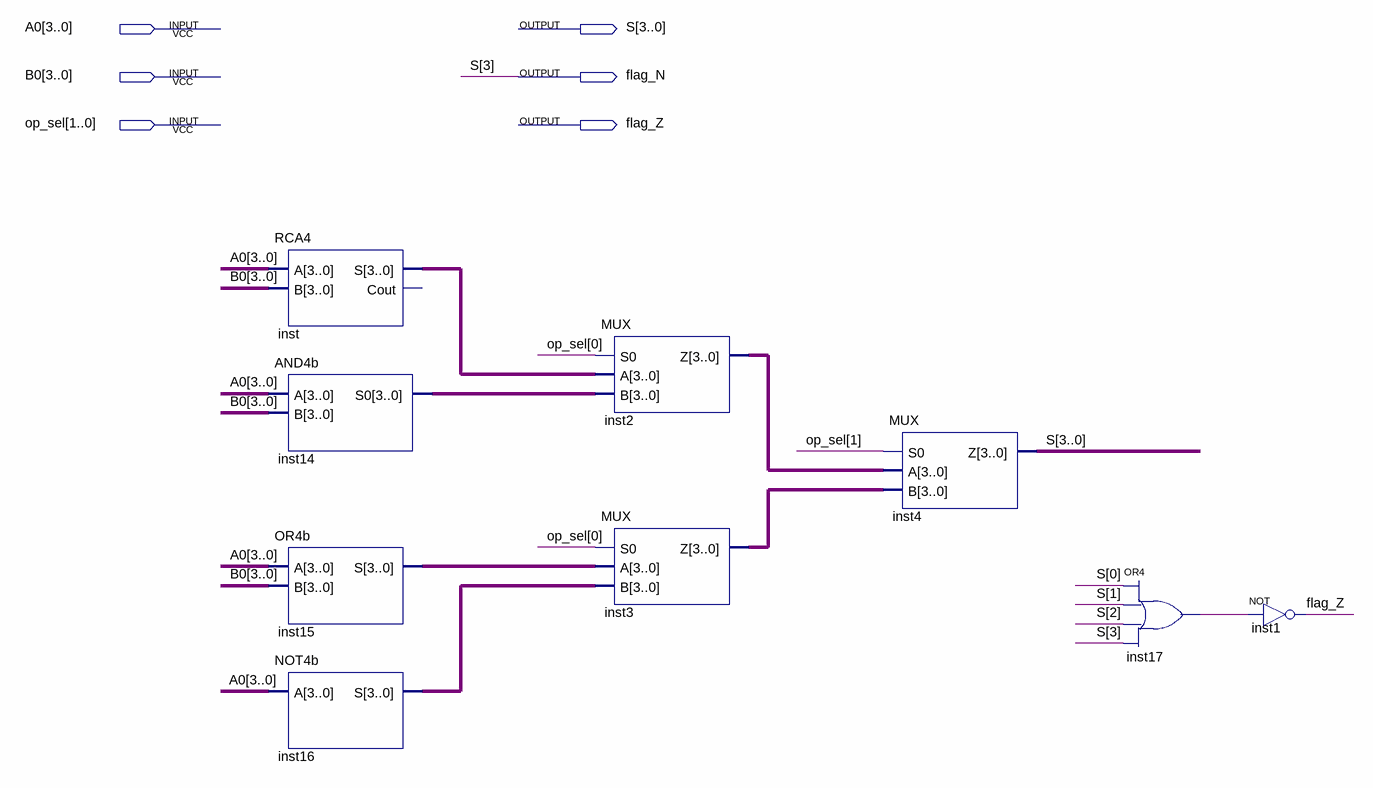
[diagram p0: schematic sheet]
// Quartus schematic ULA.bdf as structural Verilog: 9 symbols, 6 pins
module ULA (
  input  [3:0] A0,
  input  [3:0] B0,
  input  [1:0] op_sel,
  output [3:0] S,
  output flag_N,
  output flag_Z
);

  wire inst17_out;
  wire [3:0] inst2_z, inst3_z, inst14_s0, inst15_s, inst16_s, inst_s;

  RCA4 inst (.A(A0), .B(B0), .S(inst_s));  // open: Cout
  AND4b inst14 (.A(A0), .B(B0), .S0(inst14_s0));
  OR4b inst15 (.A(A0), .B(B0), .S(inst15_s));
  NOT4b inst16 (.A(A0), .S(inst16_s));
  MUX inst2 (.S0(op_sel[0]), .A(inst_s), .B(inst14_s0), .Z(inst2_z));
  MUX inst3 (.S0(op_sel[0]), .A(inst15_s), .B(inst16_s), .Z(inst3_z));
  MUX inst4 (.S0(op_sel[1]), .A(inst2_z), .B(inst3_z), .Z({flag_N, S[2:0]}));
  or inst17 (inst17_out, S[0], S[1], S[2], flag_N);
  not inst1 (flag_Z, inst17_out);

  assign S[3] = flag_N;
endmodule
